# Altium schematic sheet FlybackDriverZVS.SchDoc: FlybackDriverZVS
size A4; Author: Lordz Zidel; Engineer: Lordz Zidel; DocumentNumber: 1; Revision: v0p5_LTE; SheetNumber: 1; DocumentName: FlybackDriverZVS; ProjectName: FlybackDriverZVS
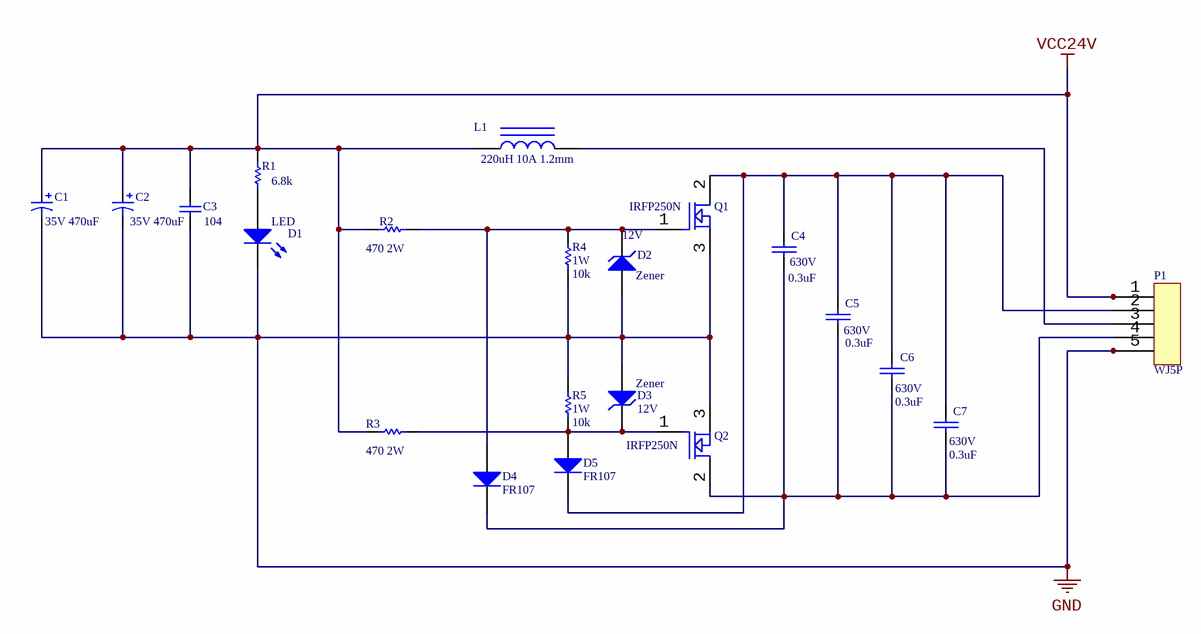
[diagram p0: FlybackDriverZVS.SchDoc]

## Parts
C1  value 35V 470uF  [C4_5_10mm]
C2  value 35V 470uF  [C4_5_10mm]
C3  value 104  [RAD-0.3]
C4  value 630V  Capacitance: 0.3uF  [MKP_Capacitor]
C5  value 630V  Capacitance: 0.3uF  [MKP_Capacitor]
C6  value 630V  Capacitance: 0.3uF  [MKP_Capacitor]
C7  value 630V  Capacitance: 0.3uF  [MKP_Capacitor]
D1  (no value)  [0805]
D2  12V  [DIODE-0.4]
D3  12V  [DIODE-0.4]
D4  FR107  [DIODE-0.4]
D5  FR107  [DIODE-0.4]
L1  value 220uH 10A 1.2mm  [HBL_30_10_H]
P1  WJ5P  [CJ_10x5]
Q1  IRFP250N  [TO-247AC_ZCEDGE]
Q2  IRFP250N  [TO-247AC_ZCEDGE]
R1  value 6.8k  [AXIAL-0.3]
R2  value 470 2W  [2WZC]
R3  value 470 2W  [2WZC]
R4  1W  value 10k  [1WZC]
R5  1W  value 10k  [1WZC]

## Nets
GND: C1.2 C2.2 C3.1 D1.2(K) D2.1(A) D3.1(A) P1.5 Q1.3(S) Q2.3(S) R4.2 R5.1
VCC24V: C1.1 C2.1 C3.2 L1.1 P1.1 R1.2 R2.2 R3.2
NetC4_1: C4.1 C5.1 C6.1 C7.1 D5.2(K) P1.2 Q1.2(D)
NetC4_2: C4.2 C5.2 C6.2 C7.2 D4.2(K) P1.4 Q2.2(D)
NetD1_1: D1.1(A) R1.1
NetD2_2: D2.2(K) D4.1(A) Q1.1(G) R2.1 R4.1
NetD3_2: D3.2(K) D5.1(A) Q2.1(G) R3.1 R5.2
NetL1_2: L1.2 P1.3

## Notes on the sheet
- (near D1) LED
- (near D2) Zener
- (near D3) Zener

## Library data of the parts
C1 C2 = Cap Pol1: Polarized Capacitor (Radial); pin to pad: 1>2 2>1; Published: 8-Jun-2000; LatestRevisionDate: 17-Jul-2002; LatestRevisionNote: Re-released for DXP Platform.; PackageReference: RB7.6-15; Publisher: Altium Limited; PackageDescription: Polarized Capacitor (Radial); 2 Leads
C3 = Cap: Capacitor; Published: 8-Jun-2000; LatestRevisionDate: 17-Jul-2002; LatestRevisionNote: Re-released for DXP Platform.; PackageReference: RAD-0.3; Publisher: Altium Limited; PackageDescription: Radial Cap, Thru-Hole; 2 Leads; 0.3 in Pin Spacing
C4-C7 = 普通电容: Capacitor
D1 = LED3: Typical BLUE SiC LED; Published: 8-Jun-2000; LatestRevisionDate: 17-Dec-2003; LatestRevisionNote: PCB Footprint replaced.; DatasheetVersion: 16-Apr-2002; PackageVersion: 16-Apr-2002; PackageReference: 3.5X2.8X1.9; Publisher: Altium Limited; PackageDescription: SM LED; 2 C-Bend Leads; Body 3.5 x 2.8 x 1.9 mm, inc leads (LxWxH typ)
D2 D3 = D Zener: Zener Diode; Published: 8-Jun-2000; LatestRevisionDate: 17-Jul-2002; LatestRevisionNote: Re-released for DXP Platform.; PackageReference: DIODE-0.7; Publisher: Altium Limited; PackageDescription: Diode, Thru-Hole; 2 Leads; 0.7 in Pin Spacing
D4 D5 = Diode 1N4007: 1 Amp General Purpose Rectifier; Published: 8-Jun-2000; LatestRevisionDate: 17-Jul-2002; LatestRevisionNote: Re-released for DXP Platform.; DatasheetVersion: 1998; PackageVersion: Aug-1999; PackageReference: DO-41; Publisher: Altium Limited; PackageDescription: Diode, Axial; Body 5.2 x 2.7 mm (LxDia. max), Lead Dia. 0.86 mm (max); Code_JEDEC: DO-204-AL; ComponentLink1Description: Manufacturer Link; ComponentLink1URL: http://www.fairchildsemi.com/; ComponentLink2Description: Datasheet; ComponentLink2URL: http://www.fairchildsemi.com/ds/1N%2F1N4001.pdf
L1 = Inductor Iron: Magnetic-Core Inductor; Published: 24-Mar-1999; LatestRevisionDate: 17-Jul-2002; LatestRevisionNote: Re-released for DXP Platform.; PackageReference: AXIAL-0.9; Publisher: Altium Limited; PackageDescription: Axial Device, Thru-Hole; 2 Leads; 0.9 in Pin Spacing
P1 = WJ5P_381
Q1 Q2 = MOSFET N: pin to pad: 1>G 2>D 3>S; Max Voltage: 200V; Max Current: 50A
R1-R5 = Res1: Resistor; Published: 8-Jun-2000; LatestRevisionDate: 17-Jul-2002; LatestRevisionNote: Re-released for DXP Platform.; PackageReference: AXIAL-0.3; Publisher: Altium Limited; PackageDescription: Axial Device, Thru-Hole; 2 Leads; 0.3 in Pin Spacing